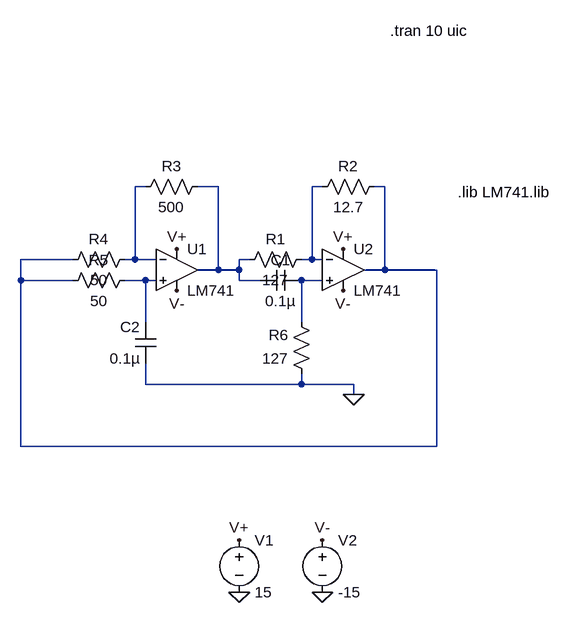
[diagram p0: schematic Draft29.asc]
Draft29.asc, the LTspice schematic file:
Version 4
SHEET 1 880 848
WIRE 128 -368 112 -368
WIRE 240 -368 208 -368
WIRE 400 -368 384 -368
WIRE 496 -368 480 -368
WIRE 16 -256 -64 -256
WIRE 112 -256 112 -368
WIRE 112 -256 96 -256
WIRE 144 -256 112 -256
WIRE 288 -256 272 -256
WIRE 384 -256 384 -368
WIRE 384 -256 368 -256
WIRE 400 -256 384 -256
WIRE 240 -240 240 -368
WIRE 240 -240 208 -240
WIRE 272 -240 272 -256
WIRE 272 -240 240 -240
WIRE 496 -240 496 -368
WIRE 496 -240 464 -240
WIRE 576 -240 496 -240
WIRE -64 -224 -64 -256
WIRE 16 -224 -64 -224
WIRE 128 -224 96 -224
WIRE 144 -224 128 -224
WIRE 272 -224 272 -240
WIRE 304 -224 272 -224
WIRE 400 -224 368 -224
WIRE 128 -160 128 -224
WIRE 368 -160 368 -224
WIRE 128 -64 128 -96
WIRE 368 -64 368 -80
WIRE 368 -64 128 -64
WIRE 448 -64 368 -64
WIRE 448 -48 448 -64
WIRE -64 32 -64 -224
WIRE 576 32 576 -240
WIRE 576 32 -64 32
FLAG 400 256 0
FLAG 272 256 0
FLAG 272 176 V+
FLAG 400 176 V-
FLAG 448 -48 0
FLAG 432 -208 V-
FLAG 176 -208 V-
FLAG 432 -272 V+
FLAG 176 -272 V+
SYMBOL voltage 272 160 R0
SYMATTR InstName V1
SYMATTR Value 15
SYMBOL voltage 400 160 R0
SYMATTR InstName V2
SYMATTR Value -15
SYMBOL Opamps/opamp2 176 -304 R0
SYMATTR InstName U1
SYMATTR Value LM741
SYMBOL Opamps/opamp2 432 -304 R0
SYMATTR InstName U2
SYMATTR Value LM741
SYMBOL res 384 -272 R90
WINDOW 0 0 56 VBottom 2
WINDOW 3 32 56 VTop 2
SYMATTR InstName R1
SYMATTR Value 127
SYMBOL res 496 -384 R90
WINDOW 0 0 56 VBottom 2
WINDOW 3 32 56 VTop 2
SYMATTR InstName R2
SYMATTR Value 12.7
SYMBOL res 224 -384 R90
WINDOW 0 0 56 VBottom 2
WINDOW 3 32 56 VTop 2
SYMATTR InstName R3
SYMATTR Value 500
SYMBOL res 112 -272 R90
WINDOW 0 0 56 VBottom 2
WINDOW 3 32 56 VTop 2
SYMATTR InstName R4
SYMATTR Value 50
SYMBOL res 112 -240 R90
WINDOW 0 0 56 VBottom 2
WINDOW 3 32 56 VTop 2
SYMATTR InstName R5
SYMATTR Value 50
SYMBOL res 384 -64 R180
WINDOW 0 36 76 Left 2
WINDOW 3 36 40 Left 2
SYMATTR InstName R6
SYMATTR Value 127
SYMBOL cap 368 -240 R90
WINDOW 0 0 32 VBottom 2
WINDOW 3 32 32 VTop 2
SYMATTR InstName C1
SYMATTR Value 0.1µ
SYMBOL cap 144 -96 R180
WINDOW 0 24 56 Left 2
WINDOW 3 24 8 Left 2
SYMATTR InstName C2
SYMATTR Value 0.1µ
TEXT 608 -360 Left 2 !.lib LM741.lib
TEXT 504 -608 Left 2 !.tran 10 uic

The netlist it stands for:
* Draft29.asc
V1 V+ 0 15
V2 V- 0 -15
XU1 N005 N001 V+ V- N002 LM741  ; pins In+ In- V+ V- OUT
XU2 N006 N003 V+ V- N004 LM741  ; pins In+ In- V+ V- OUT
R1 N003 N002 127
R2 N004 N003 12.7
R3 N002 N001 500
R4 N001 N004 50
R5 N005 N004 50
R6 0 N006 127
C1 N006 N002 0.1µ
C2 0 N005 0.1µ
.lib LM741.lib
.tran 10 uic
.backanno
.end